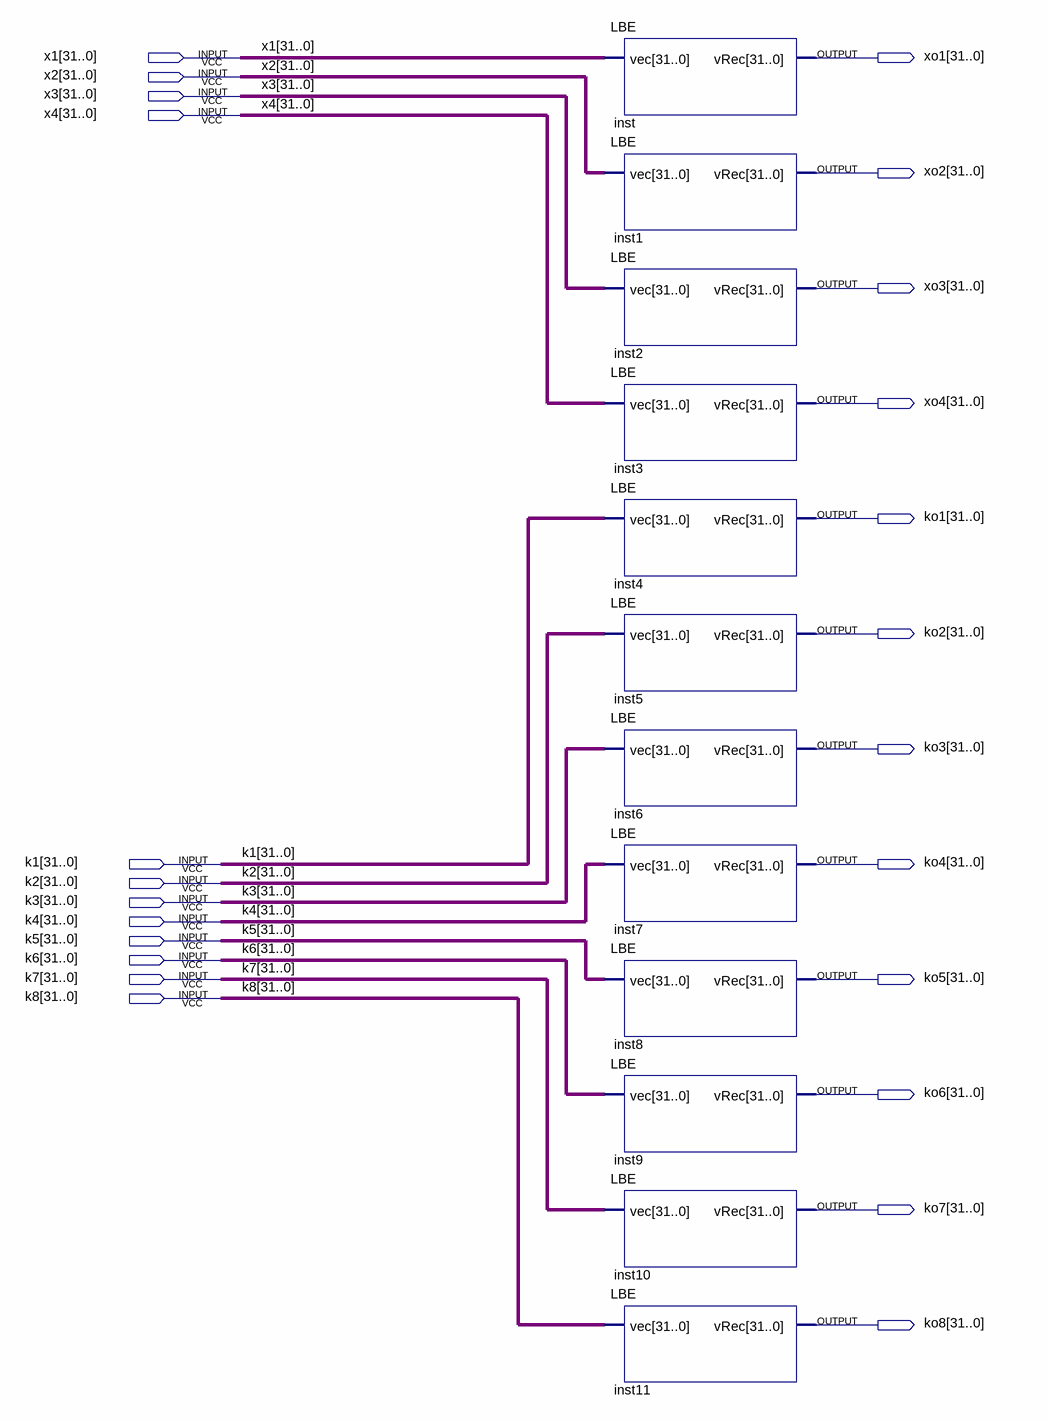
[diagram p0: schematic sheet]
// Quartus schematic LBE_block.bdf as structural Verilog: 12 symbols, 24 pins
module LBE_block (
  input  [31:0] x1,
  input  [31:0] x2,
  input  [31:0] x3,
  input  [31:0] x4,
  input  [31:0] k1,
  input  [31:0] k2,
  input  [31:0] k3,
  input  [31:0] k4,
  input  [31:0] k5,
  input  [31:0] k6,
  input  [31:0] k7,
  input  [31:0] k8,
  output [31:0] xo1,
  output [31:0] xo2,
  output [31:0] xo3,
  output [31:0] xo4,
  output [31:0] ko1,
  output [31:0] ko2,
  output [31:0] ko3,
  output [31:0] ko4,
  output [31:0] ko5,
  output [31:0] ko6,
  output [31:0] ko7,
  output [31:0] ko8
);

  LBE inst (.vec(x1), .vRec(xo1));
  LBE inst1 (.vec(x2), .vRec(xo2));
  LBE inst2 (.vec(x3), .vRec(xo3));
  LBE inst3 (.vec(x4), .vRec(xo4));
  LBE inst4 (.vec(k1), .vRec(ko1));
  LBE inst5 (.vec(k2), .vRec(ko2));
  LBE inst6 (.vec(k3), .vRec(ko3));
  LBE inst7 (.vec(k4), .vRec(ko4));
  LBE inst8 (.vec(k5), .vRec(ko5));
  LBE inst9 (.vec(k6), .vRec(ko6));
  LBE inst10 (.vec(k7), .vRec(ko7));
  LBE inst11 (.vec(k8), .vRec(ko8));
endmodule
